# EAGLE design rapidshark-lipo-sensor-mk-3.3 (EAGLE 7.5.0)
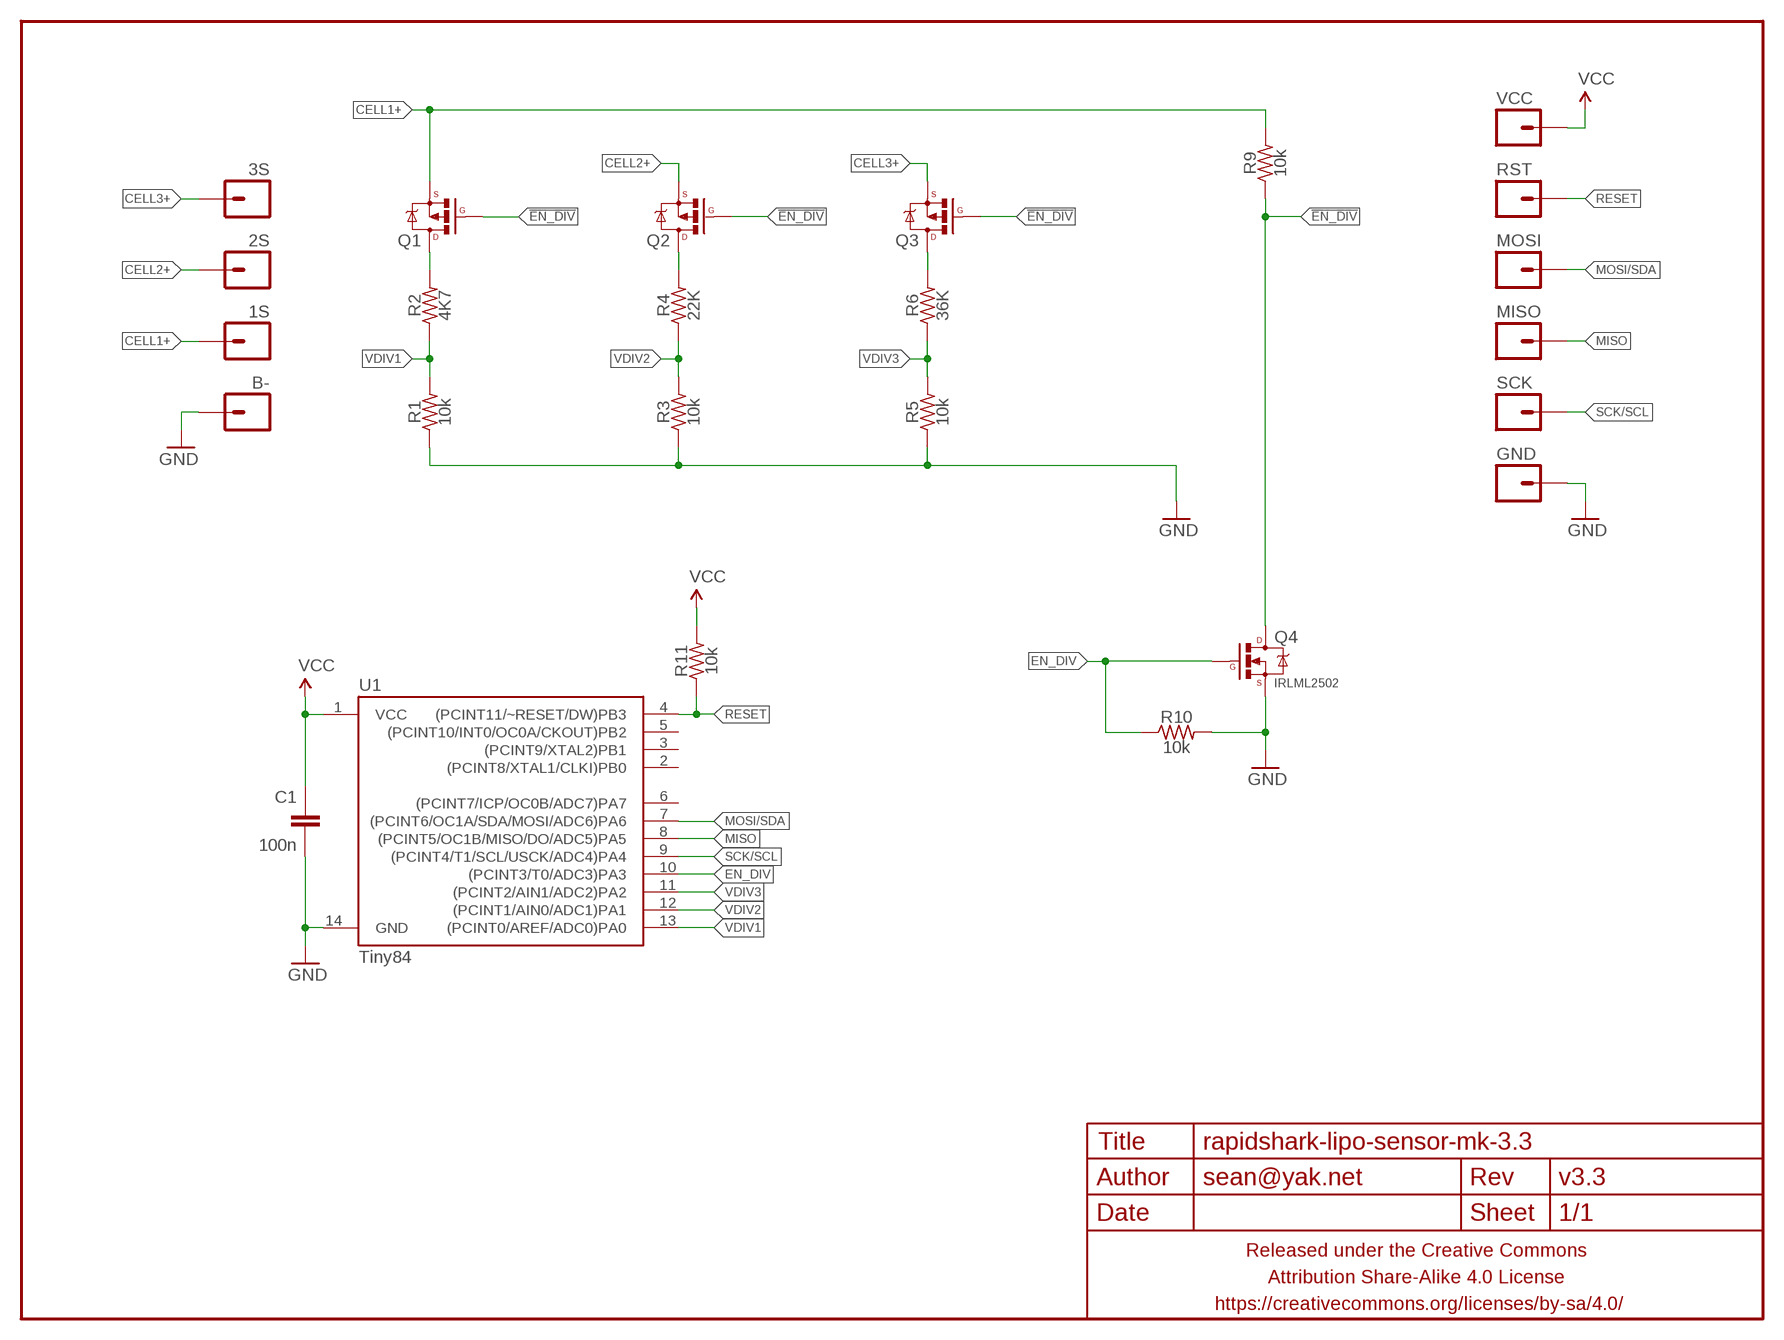
[diagram p0: schematic, sheet 1]

## Parts
1S  M01PTH-0.9MM  [1X01-0.9MM]
2S  M01PTH-0.9MM  [1X01-0.9MM]
3S  M01PTH-0.9MM  [1X01-0.9MM]
B-  M01PTH-0.9MM  [1X01-0.9MM]
C1  100n  CAPACITOR-CERAMICC0603-TIGHTER  [C0603-TIGHTER]
FRAME1  FRAME-LETTERNO_PACKAGE  [DUMMY]
GND  M01PTH-0.9MM  [1X01-0.9MM]
MISO  M01PTH-0.9MM  [1X01-0.9MM]
MOSI  M01PTH-0.9MM  [1X01-0.9MM]
Q1  MOSFET-PCHANNELSOT-23  [SOT23]
Q2  MOSFET-PCHANNELSOT-23  [SOT23]
Q3  MOSFET-PCHANNELSOT-23  [SOT23]
Q4  IRLML2502  MOSFET-NCHANNELIRLML2502  [SOT23]
R1  10k  RESISTORR0603-TIGHTER  [R0603-TIGHTER]
R2  4K7  RESISTORR0603-TIGHTER  [R0603-TIGHTER]
R3  10k  RESISTORR0603-TIGHTER  [R0603-TIGHTER]
R4  22K  RESISTORR0603-TIGHTER  [R0603-TIGHTER]
R5  10k  RESISTORR0603-TIGHTER  [R0603-TIGHTER]
R6  36K  RESISTORR0603-TIGHTER  [R0603-TIGHTER]
R9  10k  RESISTORR0603-TIGHTER  [R0603-TIGHTER]
R10  10k  RESISTORR0603-TIGHTER  [R0603-TIGHTER]
R11  10k  RESISTORR0603-TIGHTER  [R0603-TIGHTER]
RST  M01PTH-0.9MM  [1X01-0.9MM]
SCK  M01PTH-0.9MM  [1X01-0.9MM]
U1  Tiny84  ATTINY84  [SO14]
VCC  M01PTH-0.9MM  [1X01-0.9MM]

## Nets
!EN_DIV: Q1.1(G) Q2.1(G) Q3.1(G) Q4.3(D) R9.1
CELL1+: 1S.1 Q1.2(S) R9.2
CELL2+: 2S.1 Q2.2(S)
CELL3+: 3S.1 Q3.2(S)
EN_DIV: Q4.1(G) R10.1 U1.10((PCINT3/T0/ADC3)PA3)
GND: B-.1 C1.2 GND.1 Q4.2(S) R1.1 R3.1 R5.1 R10.2 U1.14(GND)
MISO: MISO.1 U1.8((PCINT5/OC1B/MISO/DO/ADC5)PA5)
MOSI/SDA: MOSI.1 U1.7((PCINT6/OC1A/SDA/MOSI/ADC6)PA6)
N$2: Q2.3(D) R4.2
N$3: Q3.3(D) R6.2
N$6: Q1.3(D) R2.2
RESET: R11.1 RST.1 U1.4((PCINT11/~RESET/DW)PB3)
SCK/SCL: SCK.1 U1.9((PCINT4/T1/SCL/USCK/ADC4)PA4)
VCC: C1.1 R11.2 U1.1(VCC) VCC.1
VDIV1: R1.2 R2.1 U1.13((PCINT0/AREF/ADC0)PA0)
VDIV2: R3.2 R4.1 U1.12((PCINT1/AIN0/ADC1)PA1)
VDIV3: R5.2 R6.1 U1.11((PCINT2/AIN1/ADC2)PA2)
Unconnected: U1.2((PCINT8/XTAL1/CLKI)PB0) U1.3((PCINT9/XTAL2)PB1) U1.5((PCINT10/INT0/OC0A/CKOUT)PB2) U1.6((PCINT7/ICP/OC0B/ADC7)PA7)

## Library data of the parts
1S 2S 3S B- GND MISO MOSI RST SCK VCC = a_parts:M01: Header 1 Standard 1-pin 0.1" header. Use with straight break away headers (SKU : PRT-00116), right angle break away headers (PRT-00553), swiss pins (PRT-00743), machine pins (PRT-00117), and female headers (PRT-00115).
C1 = a_parts:CAPACITOR-CERAMIC: CAPACITOR, European symbol
FRAME1 = A_butts:FRAME-LETTER: Schematic Frame Standard 8.5x11 US Letter frame; DESIGNER: sean@yak.net; VERSION: v3.3
Q1-Q3 = a_parts:MOSFET-PCHANNEL: Generic PMOSFET IRLML2244 - TRANS-11153 (SOT-23 -20V -4.3A) (1.Gate 2.Source 3.Drain) FQP27P06 - COM-10349 <http://www.sparkfun.com/products/10349> (TO-220 -60V -27A) (1.Gate 2.Source 3.Drain)
Q4 = a_parts:MOSFET-NCHANNEL: Common NMOSFET Parts MFG P/N Store ID Prod ID FDD8780 TRANS-09984 SI7820DN TRANS-11055 FDS6630A IC-08089 2N7002PW TRANS-11151 FQP30N06L COM-10213 TRANS-10060 BSS123LT1G TRANS-08345 BSS138 TRANS-00830 BS170 2N7000
R1-R6 R9-R11 = a_parts:RESISTOR: RESISTOR, American symbol
U1 = A_butts:ATTINY84: Atmel 14-pin 2/4/8kB flash uC

## Board
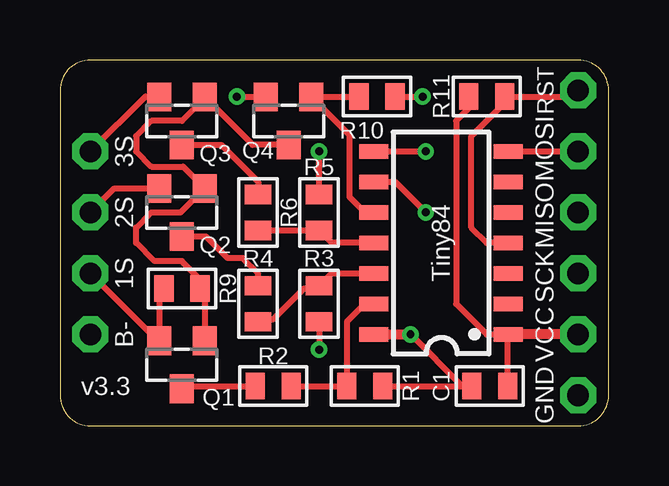
[diagram p1: board, top side]
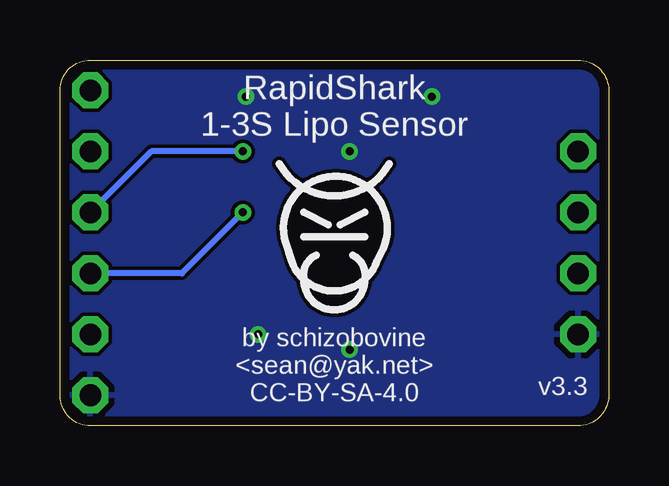
[diagram p2: board, bottom side, seen from below]

Size 22.86 x 15.24 mm. Coordinates in mm from the lower left corner, seen from the top.
Outline: 0,13.97 0,1.27 arc90 1.27,0 21.59,0 arc90 22.86,1.27 22.86,13.97 arc90 21.59,15.24 1.27,15.24 arc90 0,13.97
Copper layers (1*16): Top 0.0356mm / dielectric 1.5011mm / Bottom 0.0356mm
Design rules "LaenPCBOrder_2": minimum track width 6mil, minimum drill 13mil, track to track 6mil, track to pad 6mil, pad to pad 6mil, via to via 6mil, smd to smd 6mil, copper to edge 15mil, drill to drill 6mil, minimum pad ring 7mil, minimum via ring 7mil, stop-mask expansion 3mil, vias tented up to drill 20mil, thermal gap 10mil

### Footprints (pad centres in the part's own frame; a part is rotated, then mirrored left to right if it is on the bottom)
1X01-0.9MM = drill 0.9 pad 1.5 octagon: 1 0,0
C0603-TIGHTER = smd 0.8 x 1.1: 1 -0.75,0; 2 0.75,0
SOT23 = smd 1 x 1.2: 1 -0.95,-1; 2 0.95,-1; 3 0,1
R0603-TIGHTER = smd 0.8 x 1.1: 1 -0.75,0; 2 0.75,0
SO14 = smd 0.6 x 1.2: 1 -3.81,-2.8; 2 -2.54,-2.8; 3 -1.27,-2.8; 4 0,-2.8; 5 1.27,-2.8; 6 2.54,-2.8; 7 3.81,-2.8; 8 3.81,2.8; 9 2.54,2.8; 10 1.27,2.8; 11 0,2.8; 12 -1.27,2.8; 13 -2.54,2.8; 14 -3.81,2.8

### Placement (x,y rotation side)
1S  1.27,6.35 270 top
2S  1.27,8.89 270 top
3S  1.27,11.43 270 top
B-  1.27,3.81 270 top
C1  17.91,1.65 180 top
FRAME1  0,0 0 top
GND  21.59,1.27 90 top
MISO  21.59,8.89 90 top
MOSI  21.59,11.43 90 top
Q1  5.08,2.54 180 top
Q2  5.08,8.89 180 top
Q3  5.08,12.7 180 top
Q4  9.53,12.7 180 top
R1  12.7,1.65 180 top
R2  8.89,1.65 180 top
R3  10.79,5.08 90 top
R4  8.26,5.08 90 top
R5  10.79,8.89 270 top
R6  8.26,8.89 90 top
R9  5.08,5.71 180 top
R10  13.21,13.72 0 top
R11  17.78,13.72 180 top
RST  21.59,13.97 90 top
SCK  21.59,6.35 90 top
U1  15.88,7.62 90 top
U$1  [COW_SMALL_METAL_NOTEXT]  11.43,8.38 0 bottom
VCC  21.59,3.81 90 top

### Tracks (layer width: path | path; a pad name or v marks a point on that pad's centre or on a via)
!EN_DIV
  Top 0.254: Q1.1 6.03,5.51 R9.1 5.83,6.11 5.08,6.86 3.94,6.86 3.17,7.62 3.17,8.26 3.81,8.89 5.03,8.89 Q2.1 5.12,10.79 3.81,10.79 3.17,11.43 3.17,12.06 3.81,12.7 5.08,12.7 6.03,13.65 Q3.1 8.03,11.7 Q4.3
CELL1+
  Top 0.254: 1S.1 4.08,3.54 Q1.2 4.13,5.51 R9.2
CELL2+
  Top 0.254: 2S.1 2.27,9.89 Q2.2
CELL3+
  Top 0.254: 3S.1 3.56,13.72 4.11,13.72 Q3.2
EN_DIV
  Top 0.254: R10.1 12.44,13.7 Q4.1 12.06,12.11 12.06,9.53 12.7,8.89 U1.10
GND  (via drill 0.33)
  Top 0.254: R3.1 v10.79,3.17 | R5.1 v10.79,11.43 | v7.37,13.72 8.56,13.72 Q4.2 | R10.2 v15.11,13.72 | v14.61,3.81 16.76,1.65 C1.2 R1.1
  Top 0.406: U1.14 v14.61,3.81
  pour Bottom: 1.27,15.24 21.59,15.24 arc-90 22.86,13.97 22.86,1.27 arc-90 21.59,0 1.27,0 arc-90 0,1.27 0,13.97 arc-90
MISO  (via drill 0.33)
  Top 0.254: U1.8 v15.24,11.43
  Bottom 0.254: v15.24,11.43 19.05,11.43 MISO.1
MOSI/SDA
  Top 0.254: U1.7 MOSI.1
N$2
  Top 0.254: Q2.3 6.08,7.89 6.29,7.68 6.35,7.62 6.99,6.99 7.62,6.99 8.26,6.35 R4.2
N$3
  Top 0.254: Q3.3 6.71,11.7 8.26,10.16 R6.2
N$6
  Top 0.254: Q1.3 5.19,1.65 R2.2
RESET
  Top 0.254: U1.4 17.78,7.62 17.14,8.26 17.14,12.06 18.53,13.45 R11.1 21.34,13.72 RST.1
SCK/SCL  (via drill 0.33)
  Top 0.254: U1.9 13.97,10.16 v15.24,8.89
  Bottom 0.254: v15.24,8.89 17.78,6.35 SCK.1
VCC
  Top 0.254: R11.2 17.03,13.22 16.51,12.7 16.51,5.08 17.78,3.81 U1.1 18.66,3.79 C1.1
  Top 0.406: VCC.1 U1.1
VDIV1
  Top 0.254: R2.1 R1.2 11.95,4.33 12.7,5.08 U1.13
VDIV2
  Top 0.254: U1.12 11.31,6.35 R3.2 10.68,5.71 10.16,5.71 8.89,4.45 8.37,4.45 R4.1
VDIV3
  Top 0.254: R6.1 R5.2 11.31,7.62 U1.11

### Text on the board
bPlace: RapidShark / 1-3S Lipo Sensor | by schizobovine / <sean@yak.net> / CC-BY-SA-4.0